# EAGLE design TSOC_USBUART2 (EAGLE 6.6.0)
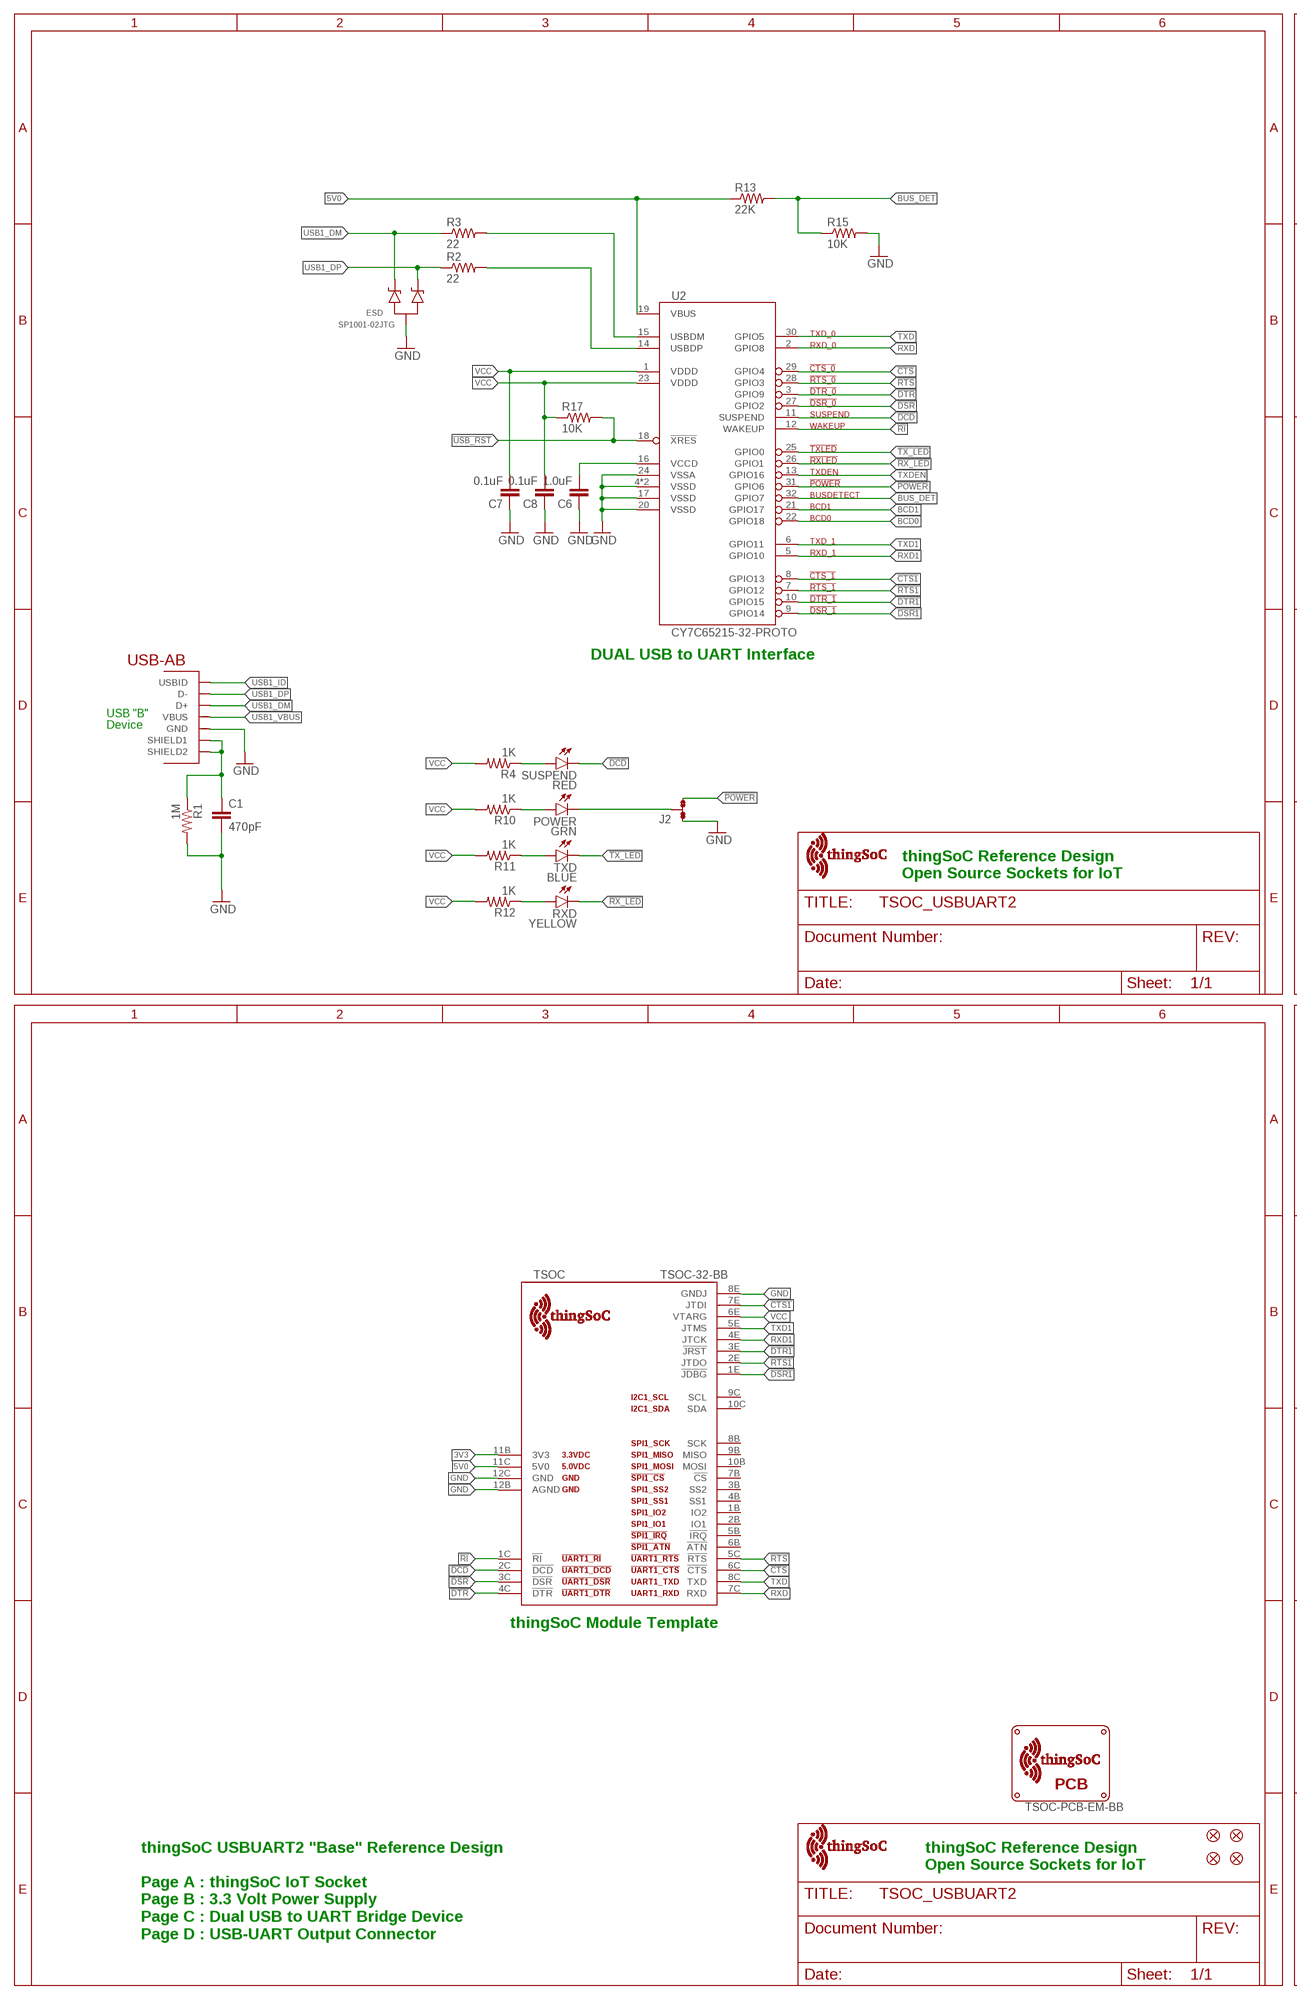
[diagram p0: schematic, sheet 1, part 1 of 2]
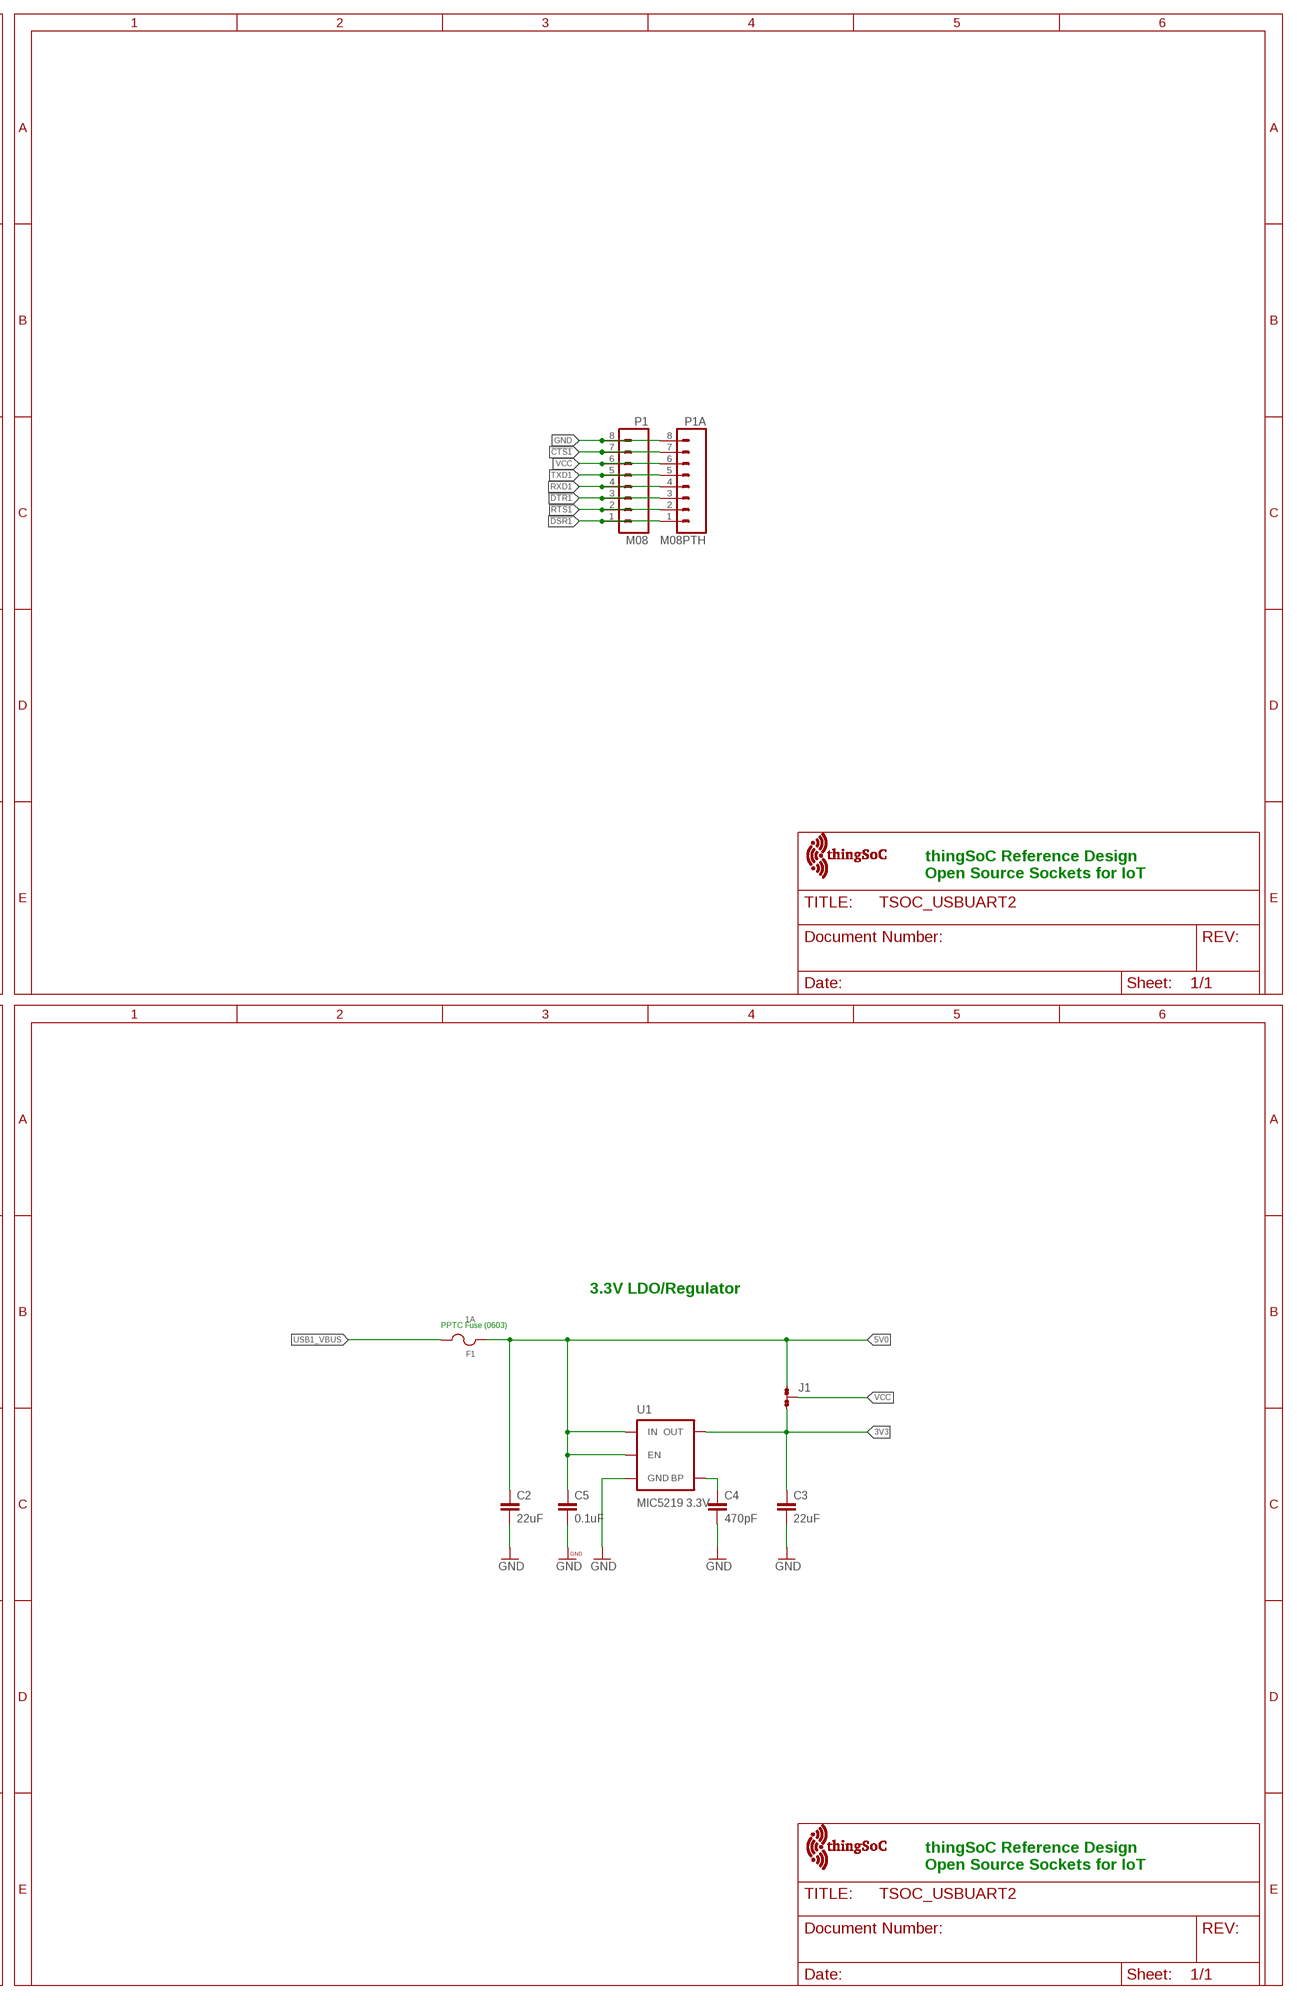
[diagram p1: schematic, sheet 1, part 2 of 2]

## Parts
C1  470pF  CAP-0603  [EIA-0603]
C2  22uF  CAP-1206  [EIA-1206]
C3  22uF  CAP-1206  [EIA-1206]
C4  470pF  CAP-0603  [EIA-0603]
C5  0.1uF  CAP-0603  [EIA-0603]
C6  1.0uF  CAP-0603  [EIA-0603]
C7  0.1uF  CAP-0603  [EIA-0603]
C8  0.1uF  CAP-0603  [EIA-0603]
ESD  SP1001-02JTG  [SC70-3]
F1  1A  FUSE  [EIA-0603]
FID1  FIDUCIALUFIDUCIAL  [MICRO-FIDUCIAL]
FID2  FIDUCIALUFIDUCIAL  [MICRO-FIDUCIAL]
FID3  FIDUCIALUFIDUCIAL  [MICRO-FIDUCIAL]
FID4  FIDUCIALUFIDUCIAL  [MICRO-FIDUCIAL]
J1  JMP-3-1_2  [JMP-3-1_2]
J2  JMP-3-1_2  [JMP-3-1_2]
P1  M08  [1X08-SMD-FEMALE]
P1A  M08PTH  [1X08]
POWER  GRN  LED0603  [LED-0603]
R1  1M  RESISTOR-0603  [EIA-0603]
R2  22  RESISTOR-0603  [EIA-0603]
R3  22  RESISTOR-0603  [EIA-0603]
R4  1K  RESISTOR-0603  [EIA-0603]
R10  1K  RESISTOR-0603  [EIA-0603]
R11  1K  RESISTOR-0603  [EIA-0603]
R12  1K  RESISTOR-0603  [EIA-0603]
R13  22K  RESISTOR-0603  [EIA-0603]
R15  10K  RESISTOR-0603  [EIA-0603]
R17  10K  RESISTOR-0603  [EIA-0603]
RXD  YELLOW  LED0603  [LED-0603]
SUSPEND  RED  LED0603  [LED-0603]
TSOC  TSOC-32-BB  [TSOC-BB-S32]
TXD  BLUE  LED0603  [LED-0603]
U1  MIC5219 3.3V  V_REG_MIC52193.3V  [SOT23-5]
U2  CY7C65215-32-PROTO  [QFN32-PROTO]
U$1  TSOC-PCB-EM-BB  [TSOC-EM-BB]
U$3  TSOC-LOGO-LRG  [TSOC-LOGO-LRG]
U$4  TSOC-LOGO  [TSOC-LOGO-BLANK]
U$5  TSOC-LOGO  [TSOC-LOGO-BLANK]
U$6  TSOC-LOGO  [TSOC-LOGO-BLANK]
USB  USB_AB  [USB-AB-MICRO-SMD]

## Nets
3V3: C3.1 J1.3 TSOC.11B(3V3) U1.5(OUT)
5V0: C2.1 C5.1 F1.1 J1.1 R13.1 TSOC.11C(5V0) U1.1(IN) U1.3(EN) U2.19(VBUS)
!CTS: TSOC.6C(!CTS) U2.29(GPIO4)
!CTS1: P1.7 P1A.7 TSOC.7E(JTDI) U2.8(GPIO13)
!DCD: SUSPEND.C TSOC.2C(!DCD) U2.11(SUSPEND)
!DSR: TSOC.3C(!DSR) U2.27(GPIO2)
!DSR1: P1.1 P1A.1 TSOC.1E(!JDBG) U2.9(GPIO14)
!DTR: TSOC.4C(!DTR) U2.3(GPIO9)
!DTR1: P1.3 P1A.3 TSOC.3E(!JRST) U2.10(GPIO15)
!POWER: J2.3 U2.31(GPIO6)
!RI: TSOC.1C(!RI) U2.12(WAKEUP)
!RTS: TSOC.5C(!RTS) U2.28(GPIO3)
!RTS1: P1.2 P1A.2 TSOC.2E(JTDO) U2.7(GPIO12)
!RX_LED: RXD.C U2.26(GPIO1)
!TX_LED: TXD.C U2.25(GPIO0)
!USB_RST: R17.2 U2.18(!XRES)
BCD0: U2.22(GPIO18)
BCD1: U2.21(GPIO17)
BLU: R11.1 TXD.A
BUS_DET: R13.2 R15.1 U2.32(GPIO7)
BYPASS1: C4.1 U1.4(BP)
GND [vcc]: C1.2 C2.2 C3.2 C4.2 C5.2 C6.1 C7.1 C8.1 ESD.3(A) J2.1 P1.8 P1A.8 R1.2 R15.2 TSOC.8E(GNDJ) TSOC.12B(AGND) TSOC.12C(GND) U1.2(GND) U2.4(VSSD) U2.17(VSSD) U2.20(VSSD) U2.24(VSSA) U2.EXP(VSSD) USB.GND
GRN: POWER.A R10.1
PWR: J2.2 POWER.C
RED: R4.1 SUSPEND.A
RXD: TSOC.7C(RXD) U2.2(GPIO8)
RXD1: P1.4 P1A.4 TSOC.4E(JTCK) U2.5(GPIO10)
TXD: TSOC.8C(TXD) U2.30(GPIO5)
TXD1: P1.5 P1A.5 TSOC.5E(JTMS) U2.6(GPIO11)
TXDEN: U2.13(GPIO16)
USB1_DM: ESD.2(C2) R3.1 USB.D+
USB1_DP: ESD.1(C1) R2.1 USB.D-
USB1_ID: USB.ID(USBID)
USB1_M: R3.2 U2.15(USBDM)
USB1_P: R2.2 U2.14(USBDP)
USB1_SHIELD: C1.1 R1.1 USB.SHIELD1 USB.SHIELD2
USB1_VBUS: F1.2 USB.VBUS
VCC: C7.2 C8.2 J1.2 P1.6 P1A.6 R4.2 R10.2 R11.2 R12.2 R17.1 TSOC.6E(VTARG) U2.1(VDDD) U2.23(VDDD)
VCCD1: C6.2 U2.16(VCCD)
YEL: R12.1 RXD.A
Unconnected: TSOC.1B(IO2) TSOC.2B(IO1) TSOC.3B(SS2) TSOC.4B(SS1) TSOC.5B(!IRQ) TSOC.6B(!ATN) TSOC.7B(!CS) TSOC.8B(SCK) TSOC.9B(MISO) TSOC.9C(SCL) TSOC.10B(MOSI) TSOC.10C(SDA)

## Notes on the sheet
- DUAL USB to UART Interface
- USB "B"
- Device
- thingSoC Reference Design
  Open Source Sockets for IoT
- thingSoC Reference Design
  Open Source Sockets for IoT
- 3.3V LDO/Regulator
- PPTC Fuse (0603)
- thingSoC Module Template
- thingSoC Reference Design
  Open Source Sockets for IoT
- thingSoC Reference Design
  Open Source Sockets for IoT
- thingSoC USBUART2 "Base" Reference Design
  
  Page A : thingSoC IoT Socket
  Page B : 3.3 Volt Power Supply
  Page C : Dual USB to UART Bridge Device
  Page D : USB-UART Output Connector

## Library data of the parts
C1-C8 = TSOC_USBUART2:CAP: Ceramic Capacitor SMD
ESD = TSOC-ESP8266-BASE:SP1001-02JTG: Littelfuse SP1001-02JTG TVS Diode Array 8pf 15kV Source: http://www.littelfuse.com/data/en/Product_Catalogs/Littelfuse_TVS_Diode_Array_SPA_Catalog.pdf patternshed.com: created 3/25/2012
F1 = TSOC_USBUART2:FUSE: Resettable PPTC Fuse - 0603 Footptint
FID1-FID4 = TSOC-ESP8266-BASE:FIDUCIAL: Fiducial Alignment Points Various fiducial points for machine vision alignment.
J1 J2 = PatternAgents-ProtoPads:JMP-3-1_2: Three Terminal Jumper - 1 & 2 Connected Positions 1and 2 are normally connected. PatternAgents ProtoPads Library Schematic and PCB layout libraries for design patterns by PatternAgents. For the CADSoft Eagle CAD program : http://www.cadsoftusa.com/download-eagle/ Source LBR : http://www.patternagents.com Github : https://github.com/PatternAgents License : http://creativecommons.org/licenses/by-sa/4.0/ (Creative Commons 4.0) THIS SOFTWARE IS PROVIDED BY THE CONTRIBUTORS "AS IS" AND WITHOUT ANY EXPRESS OR IMPLIED WARRANTIES, INCLUDING, BUT NOT LIMITED TO, THE IMPLIED WARRANTIES OF MERCHANTABILITY AND FITNESS FOR A PARTICULAR PURPOSE ARE DISCLAIMED. IN NO EVENT SHALL THE COPYRIGHT OWNER OR CONTRIBUTORS BE LIABLE FOR ANY DIRECT, INDIRECT, INCIDENTAL, SPECIAL, EXEMPLARY, OR CONSEQUENTIAL DAMAGES (INCLUDING, BUT NOT LIMITED TO, PROCUREMENT OF SUBSTITUTE GOODS OR SERVICES; LOSS OF USE, DATA, OR PROFITS; OR BUSINESS INTERRUPTION) HOWEVER CAUSED AND ON ANY THEORY OF LIABILITY, WHETHER IN CONTRACT, STRICT LIABILITY, OR TORT (INCLUDING NEGLIGENCE OR OTHERWISE) ARISING IN ANY WAY OUT OF THE USE OF THIS SOFTWARE, EVEN IF ADVISED OF THE POSSIBILITY OF SUCH DAMAGE.; BOM: EXCLUDE
P1 P1A = TSOC_USBUART2:M08
POWER RXD SUSPEND TXD = TSOC-ESP8266-BASE:LED: LEDs Standard schematic elements and footprints for 5mm, 3mm, 1206, and 0603 sized LEDs. 5mm - Spark Fun Electronics SKU : COM-00529 (and others)
R1-R4 R10-R13 R15 R17 = TSOC_USBUART2:RESISTOR
TSOC = thingSoC:TSOC-32: thingSoC Thirty-Two (32) Pin Socket Source LBR : http://www.thingsoc.com Github : https://github.com/thingsoc License : http://creativecommons.org/licenses/by-sa/4.0/ (Creative Commons 4.0) THIS SOFTWARE IS PROVIDED BY THE CONTRIBUTORS "AS IS" AND WITHOUT ANY EXPRESS OR IMPLIED WARRANTIES, INCLUDING, BUT NOT LIMITED TO, THE IMPLIED WARRANTIES OF MERCHANTABILITY AND FITNESS FOR A PARTICULAR PURPOSE ARE DISCLAIMED. IN NO EVENT SHALL THE COPYRIGHT OWNER OR CONTRIBUTORS BE LIABLE FOR ANY DIRECT, INDIRECT, INCIDENTAL, SPECIAL, EXEMPLARY, OR CONSEQUENTIAL DAMAGES (INCLUDING, BUT NOT LIMITED TO, PROCUREMENT OF SUBSTITUTE GOODS OR SERVICES; LOSS OF USE, DATA, OR PROFITS; OR BUSINESS INTERRUPTION) HOWEVER CAUSED AND ON ANY THEORY OF LIABILITY, WHETHER IN CONTRACT, STRICT LIABILITY, OR TORT (INCLUDING NEGLIGENCE OR OTHERWISE) ARISING IN ANY WAY OUT OF THE USE OF THIS SOFTWARE, EVEN IF ADVISED OF THE POSSIBILITY OF SUCH DAMAGE.
U1 = TSOC-ESP8266-BASE:V_REG_MIC5219: V_REG MIC5219 Standard 3.3V and 5V 500mA LDO voltage regulator in SOT-23 layout. Micrel part MIC5219. BP (by-pass) pin is used to lower output noise with 470pF cap, may be left open.; PROD_ID: VREG-09872
U2 = PatternAgents-Cypress:CY7C65215-32: Cypress EZ-USB ® CY7C65215-32QFN DUAL CHANNEL USB TO UART/SPI/IC Bridge Full-Speed USB Peripheral Controller Source Data: http://www.cypress.com/?mpn=CY7C65211-24QFN LBR Source: http://www.patternagents.com THIS SOFTWARE IS PROVIDED BY THE CONTRIBUTORS "AS IS" AND WITHOUT ANY EXPRESS OR IMPLIED WARRANTIES, INCLUDING, BUT NOT LIMITED TO, THE IMPLIED WARRANTIES OF MERCHANTABILITY AND FITNESS FOR A PARTICULAR PURPOSE ARE DISCLAIMED. IN NO EVENT SHALL THE COPYRIGHT OWNER OR CONTRIBUTORS BE LIABLE FOR ANY DIRECT, INDIRECT, INCIDENTAL, SPECIAL, EXEMPLARY, OR CONSEQUENTIAL DAMAGES (INCLUDING, BUT NOT LIMITED TO, PROCUREMENT OF SUBSTITUTE GOODS OR SERVICES; LOSS OF USE, DATA, OR PROFITS; OR BUSINESS INTERRUPTION) HOWEVER CAUSED AND ON ANY THEORY OF LIABILITY, WHETHER IN CONTRACT, STRICT LIABILITY, OR TORT (INCLUDING NEGLIGENCE OR OTHERWISE) ARISING IN ANY WAY OUT OF THE USE OF THIS SOFTWARE, EVEN IF ADVISED OF THE POSSIBILITY OF SUCH DAMAGE.
U$1 = TSOC_USBUART2:TSOC-PCB: thingSoC PCB Outlines Boards Outlines for Standard Sizes (in the DImension Layer) (Registration marks in the tDocu layer - make sure to turn on tDocu/bDocu) Source LBR : http://www.thingsoc.com Github : https://github.com/thingsoc License : http://creativecommons.org/licenses/by-sa/4.0/ (Creative Commons 4.0) THIS SOFTWARE IS PROVIDED BY THE CONTRIBUTORS "AS IS" AND WITHOUT ANY EXPRESS OR IMPLIED WARRANTIES, INCLUDING, BUT NOT LIMITED TO, THE IMPLIED WARRANTIES OF MERCHANTABILITY AND FITNESS FOR A PARTICULAR PURPOSE ARE DISCLAIMED. IN NO EVENT SHALL THE COPYRIGHT OWNER OR CONTRIBUTORS BE LIABLE FOR ANY DIRECT, INDIRECT, INCIDENTAL, SPECIAL, EXEMPLARY, OR CONSEQUENTIAL DAMAGES (INCLUDING, BUT NOT LIMITED TO, PROCUREMENT OF SUBSTITUTE GOODS OR SERVICES; LOSS OF USE, DATA, OR PROFITS; OR BUSINESS INTERRUPTION) HOWEVER CAUSED AND ON ANY THEORY OF LIABILITY, WHETHER IN CONTRACT, STRICT LIABILITY, OR TORT (INCLUDING NEGLIGENCE OR OTHERWISE) ARISING IN ANY WAY OUT OF THE USE OF THIS SOFTWARE, EVEN IF ADVISED OF THE POSSIBILITY OF SUCH DAMAGE.
U$3-U$6 = thingSoC:TSOC-LOGO: thingSoC Logo Source LBR : http://www.thingsoc.com Github : https://github.com/thingsoc License : http://creativecommons.org/licenses/by-sa/4.0/ (Creative Commons 4.0) THIS SOFTWARE IS PROVIDED BY THE CONTRIBUTORS "AS IS" AND WITHOUT ANY EXPRESS OR IMPLIED WARRANTIES, INCLUDING, BUT NOT LIMITED TO, THE IMPLIED WARRANTIES OF MERCHANTABILITY AND FITNESS FOR A PARTICULAR PURPOSE ARE DISCLAIMED. IN NO EVENT SHALL THE COPYRIGHT OWNER OR CONTRIBUTORS BE LIABLE FOR ANY DIRECT, INDIRECT, INCIDENTAL, SPECIAL, EXEMPLARY, OR CONSEQUENTIAL DAMAGES (INCLUDING, BUT NOT LIMITED TO, PROCUREMENT OF SUBSTITUTE GOODS OR SERVICES; LOSS OF USE, DATA, OR PROFITS; OR BUSINESS INTERRUPTION) HOWEVER CAUSED AND ON ANY THEORY OF LIABILITY, WHETHER IN CONTRACT, STRICT LIABILITY, OR TORT (INCLUDING NEGLIGENCE OR OTHERWISE) ARISING IN ANY WAY OUT OF THE USE OF THIS SOFTWARE, EVEN IF ADVISED OF THE POSSIBILITY OF SUCH DAMAGE.
USB = BeeSafe:USB_AB: This is a USB AB connector that is compatible with USB OTG. i.e. this connector can serve as a host or device

## Net classes
1 vcc: width 0.254 mm

## Board
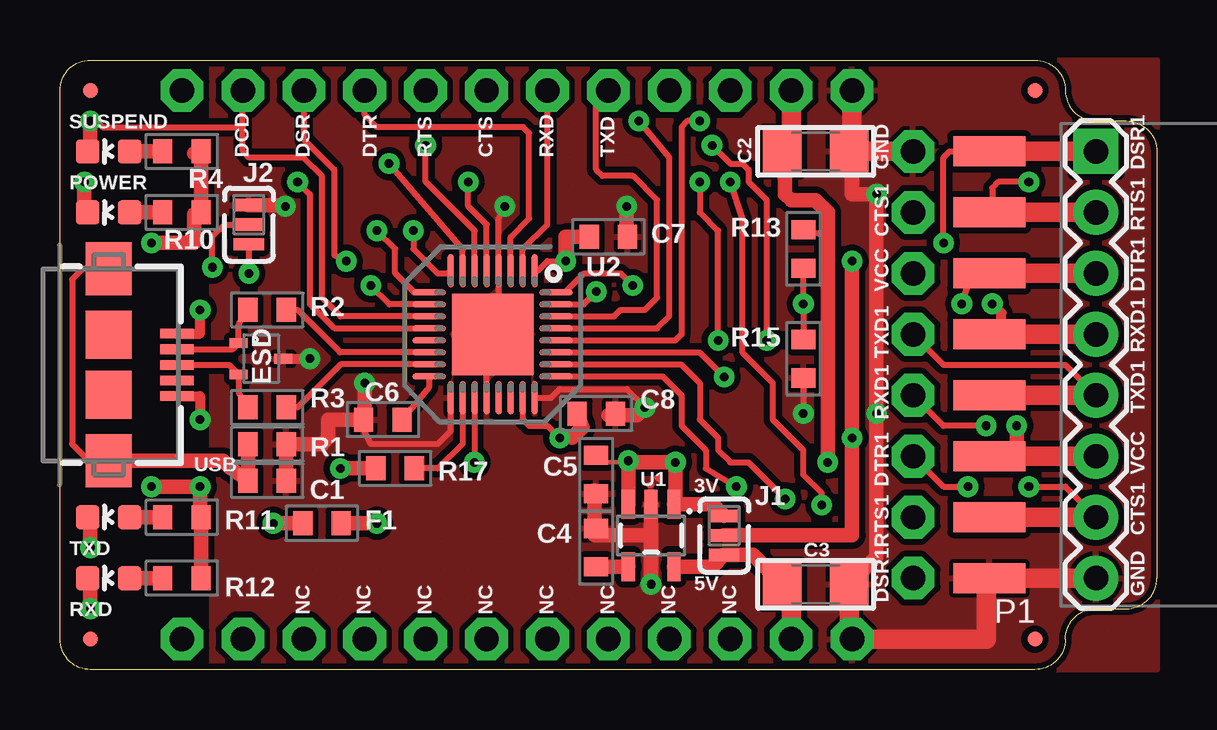
[diagram p2: board, top side]
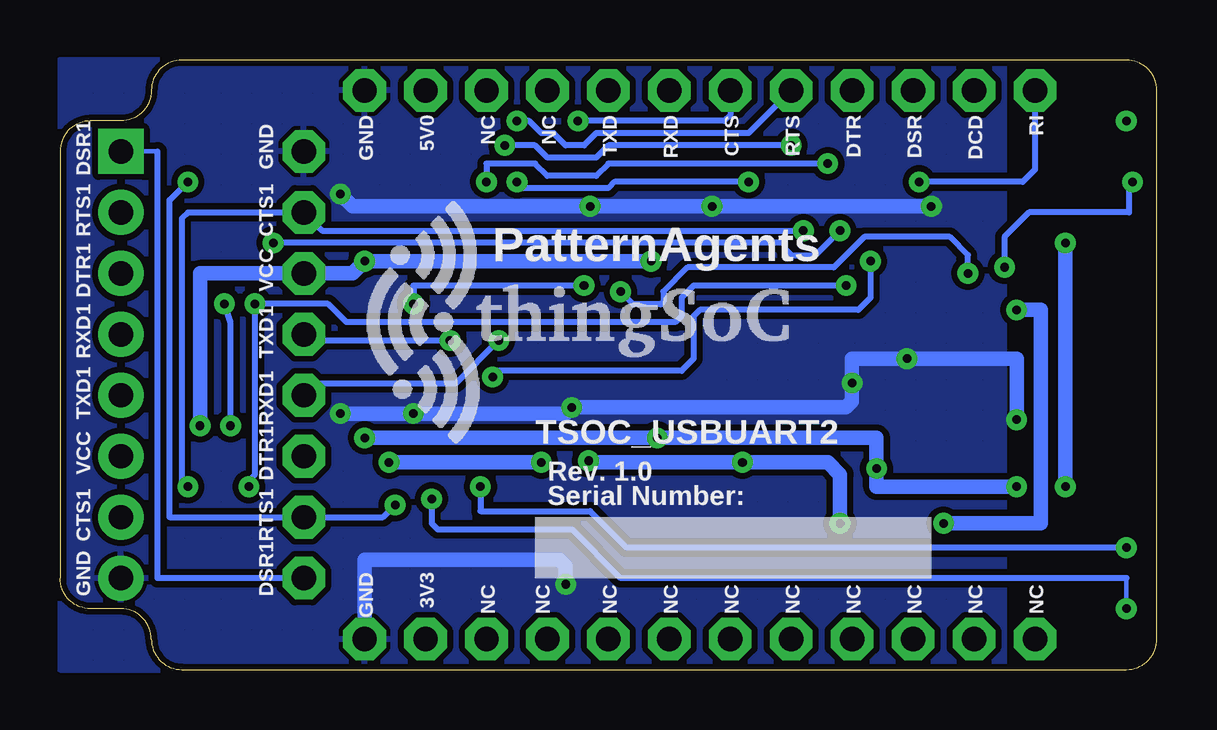
[diagram p3: board, bottom side, seen from below]

Size 45.72 x 25.4 mm. Coordinates in mm from the lower left corner, seen from the top.
Copper layers (1*16): Top 0.035mm / dielectric 1.5mm / Bottom 0.035mm
Design rules "PatternAgents_7mil": minimum track width 7mil, minimum drill 14mil, track to track 7mil, track to pad 7mil, pad to pad 7mil, via to via 7mil, smd to smd 7mil, copper to edge 7mil, drill to drill 7mil, minimum pad ring 12mil, minimum via ring 10mil, stop-mask expansion 4mil, vias tented up to drill 25mil, thermal gap 7mil

### Footprints (pad centres in the part's own frame; a part is rotated, then mirrored left to right if it is on the bottom)
EIA-0603 = smd 0.8 x 1: 1 -0.8,0; 2 0.8,0
EIA-1206 = smd 1.6 x 1.8: 1 -1.4,0; 2 1.4,0
SC70-3 = smd 0.4 x 0.75: 1 -0.65,-0.925; 2 0.65,-0.925; 3 0,0.925
MICRO-FIDUCIAL = smd 0.635 x 0.635: 1 0,0
JMP-3-1_2 = smd 0.508 x 1.27: 1 -0.813,0; 2 0,0; 3 0.813,0
1X08-SMD-FEMALE = smd 1.25 x 3: 1 8.89,3.425; 2 6.35,3.425; 3 3.81,3.425; 4 1.27,3.425; 5 -1.27,3.425; 6 -3.81,3.425; 7 -6.35,3.425; 8 -8.89,3.425
1X08 = drill 1.016 pad 1.88 square: 1 0,0 | drill 1.016 pad 1.88: 2 2.54,0; 3 5.08,0; 4 7.62,0; 5 10.16,0; 6 12.7,0; 7 15.24,0; 8 17.78,0
LED-0603 = smd 1 x 1: A 0,-0.877; C 0,0.877
TSOC-BB-S32 = drill 1.016 pad 1.778 octagon: 1B -11.43,-11.43; 1C -11.43,11.43; 1E 19.05,-8.89; 2B -8.89,-11.43; 2C -8.89,11.43; 2E 19.05,-6.35; 3B -6.35,-11.43; 3C -6.35,11.43; 3E 19.05,-3.81; 4B -3.81,-11.43; 4C -3.81,11.43; 4E 19.05,-1.27; 5B -1.27,-11.43; 5C -1.27,11.43; 5E 19.05,1.27; 6B 1.27,-11.43; 6C 1.27,11.43; 6E 19.05,3.81; 7B 3.81,-11.43; 7C 3.81,11.43; 7E 19.05,6.35; 8B 6.35,-11.43; 8C 6.35,11.43; 8E 19.05,8.89; 9B 8.89,-11.43; 9C 8.89,11.43; 10B 11.43,-11.43; 10C 11.43,11.43; 11B 13.97,-11.43; 11C 13.97,11.43; 12B 16.51,-11.43; 12C 16.51,11.43
SOT23-5 = smd 0.55 x 1.2: 1 -0.95,-1.3; 2 0,-1.3; 3 0.95,-1.3; 4 0.95,1.3; 5 -0.95,1.3
QFN32-PROTO = smd 1.4 x 0.254: 1 -2.65,1.75; 2 -2.65,1.25; 3 -2.65,0.75; 4 -2.65,0.25; 5 -2.65,-0.25; 6 -2.65,-0.75; 7 -2.65,-1.25; 8 -2.65,-1.75; 17 2.65,-1.75; 18 2.65,-1.25; 19 2.65,-0.75; 20 2.65,-0.25; 21 2.65,0.25; 22 2.65,0.75; 23 2.65,1.25; 24 2.65,1.75 | smd 0.254 x 1.4: 9 -1.75,-2.65; 10 -1.25,-2.65; 11 -0.75,-2.65; 12 -0.25,-2.65; 13 0.25,-2.65; 14 0.75,-2.65; 15 1.25,-2.65; 16 1.75,-2.65; 25 1.75,2.65; 26 1.25,2.65; 27 0.75,2.65; 28 0.25,2.65; 29 -0.25,2.65; 30 -0.75,2.65; 31 -1.25,2.65; 32 -1.75,2.65 | smd 3.4 x 3.4: EXP 0,0
USB-AB-MICRO-SMD = smd 1.4 x 0.4: D+ 2.85,0; D- 2.85,0.65; GND 2.85,-1.3; ID 2.85,-0.65; VBUS 2.85,1.3 | smd 1.9 x 2: P$6 0,1.25; P$7 0,-1.25 | smd 1.9 x 2.2: SHIELD1 0,4; SHIELD2 0,-4

### Placement (x,y rotation side)
C1  8.64,7.87 0 top
C2  31.5,21.59 0 top
C3  31.5,3.56 0 top
C4  22.35,5.08 90 top
C5  22.35,8.13 270 top
C6  13.46,10.41 0 top
C7  22.86,18.03 180 top
C8  22.35,10.67 180 top
ESD  8.38,12.95 270 top
F1  10.92,6.1 180 top
FID1  1.27,24.13 0 top
FID2  1.27,1.27 0 top
FID3  40.64,1.27 0 top
FID4  40.64,24.13 0 top
J1  27.69,5.59 270 top
J2  7.87,18.54 270 top
P1  42.16,12.7 90 top
P1A  43.18,21.59 270 top
POWER  2.03,19.05 90 top
R1  8.64,9.4 0 top
R2  8.64,14.99 0 top
R3  8.64,10.92 0 top
R4  5.08,21.59 0 top
R10  5.08,19.05 0 top
R11  5.08,6.35 0 top
R12  5.08,3.81 0 top
R13  30.99,17.53 270 top
R15  30.99,12.95 270 top
R17  13.97,8.38 0 top
RXD  2.03,3.81 90 top
SUSPEND  2.03,21.59 90 top
TSOC  16.51,12.7 0 top
TXD  2.03,6.35 90 top
U1  24.64,5.59 180 top
U2  18.03,13.97 270 top
U$1  19.05,12.7 0 top
U$3  29.72,14.48 0 bottom
U$4  1.27,1.27 0 top
U$5  1.27,1.27 0 top
U$6  1.27,1.27 0 top
USB  2.03,12.7 0 top

### Tracks (layer width: path | path; a pad name or v marks a point on that pad's centre or on a via)
3V3
  Top 0.61: U1.5 27.2,4.29 J1.3 28.88,4.78 C3.1
  Top 0.813: TSOC.11B 30.48,3.17 C3.1
5V0  (via drill 0.36)
  Top 0.178: C5.1 22.35,8.64 23.37,8.64 v23.69,8.7
  Top 0.254: R13.1 31.93,18.11 32,18.03 | U2.19 17.28,9.92 v17.27,8.64
  Top 0.61: J1.1 27.2,6.89 U1.1 25.65,6.95 v25.65,8.64 23.62,8.64 v23.69,8.7 | v23.69,8.7 U1.3 | v32,8.64 32,18.03 32,19.05 31.5,19.56 30.48,19.56 30.23,19.81 30.23,21.46 C2.1 30.2,21.7 30.48,21.7 | v23.68,8.71 v23.69,8.7 | F1.1 v13.21,6.1
  Top 0.813: 30.48,21.7 TSOC.11C
  Bottom 0.61: v25.65,8.64 v32,8.64 | v23.69,8.7 23.62,8.64 v17.27,8.64 13.72,8.64 13.21,8.13 v13.21,6.1
!CTS  (via drill 0.36)
  Top 0.254: U2.29 24.89,14.22 25.4,14.73 25.4,21.34 v24.13,22.86
  Bottom 0.254: TSOC.6C 17.78,23.11 18.03,22.86 v24.13,22.86
!CTS1  (via drill 0.36)
  Top 0.254: v40.39,7.62 41.91,7.62 P1A.7 | v14.73,18.29 14.73,17.53 15.75,16.51 16.17,16.51 U2.8
  Top 0.813: P1.7 P1A.7
  Bottom 0.254: v40.39,7.62 40.64,7.87 40.64,18.8 40.39,19.05 TSOC.7E 34.8,18.29 v14.73,18.29
!DCD  (via drill 0.36)
  Top 0.254: v1.27,22.86 1.52,22.86 1.78,22.61 7.62,22.61 | 7.62,22.61 TSOC.2C | U2.11 11.7,14.72 10.92,15.49 10.92,20.57 10.16,21.34 7.87,21.34 7.62,21.59 7.62,22.61
  Top 0.61: SUSPEND.C 1.27,21.59 v1.27,22.86
!DSR  (via drill 0.36)
  Top 0.254: TSOC.3C 10.16,22.1 11.43,20.83 11.43,17.27 v11.94,17.02 | v27.69,12.19 26.66,13.22 U2.27
  Bottom 0.254: v11.94,17.02 11.94,15.49 12.45,14.99 19.05,14.99 19.3,14.73 19.3,12.95 19.81,12.45 27.43,12.45 v27.69,12.19
!DSR1  (via drill 0.36)
  Top 0.254: v36.83,17.78 36.83,21.34 37.08,21.59 P1.1 | U2.9 14.76,15.72 13.97,16.51 13.97,17.53 v13.21,18.29
  Top 0.813: P1.1 P1A.1
  Bottom 0.178: P1A.1 41.66,21.59
  Bottom 0.254: TSOC.1E 41.66,3.81 41.66,21.59 | v36.83,17.78 15.49,17.78 15.49,17.53 15.24,17.27 14.22,17.27 v13.21,18.29
!DTR
  Top 0.254: TSOC.4C 12.7,23.11 13.21,22.61 19.3,22.61 19.56,22.35 19.56,18.8 18.78,18.02 U2.3
!DTR1  (via drill 0.36)
  Top 0.254: TSOC.3E 36.83,7.62 v37.85,7.62 | v37.59,15.24 37.85,16 38.1,16.51 P1.3 | U2.10 13.74,15.22 v12.95,16
  Top 0.813: P1.3 P1A.3
  Bottom 0.254: v37.85,7.62 37.85,7.87 37.59,8.13 v37.59,15.24 34.54,15.24 33.78,14.48 20.07,14.48 19.81,14.73 19.81,15.49 19.3,16 v12.95,16
!POWER  (via drill 0.36)
  Top 0.254: J2.3 v7.87,16.51 | U2.31 21.82,15.22 v22.35,15.75
  Bottom 0.254: v7.87,16.51 7.87,17.27 8.64,18.03 12.19,18.03 13.46,16.76 19.56,16.76 20.57,15.75 20.57,15.33 U2.31 21.82,15.22 v22.35,15.75
!RI  (via drill 0.36)
  Top 0.254: U2.12 11.43,14.22 10.41,15.24 10.41,19.81 v9.91,20.32
  Bottom 0.254: TSOC.1C 5.08,20.83 5.59,20.32 v9.91,20.32
!RTS  (via drill 0.36)
  Top 0.254: U2.28 25.65,13.72 25.91,13.97 25.91,22.61 26.16,22.86 v26.67,22.86
  Bottom 0.254: TSOC.5C 17.02,22.35 23.37,22.35 23.88,21.84 24.64,21.84 25.15,22.35 25.65,22.35 26.16,22.86 v26.67,22.86
!RTS1  (via drill 0.36)
  Top 0.254: v40.39,20.32 39.12,20.32 38.86,20.07 38.86,19.17 P1.2 | U2.7 16.78,17.51 v13.72,21.08 | v31.75,6.86 31.75,7.37 30.99,8.13 30.99,9.14 29.72,10.41 29.72,11.94 28.45,13.21 28.45,18.8 v27.94,20.32
  Top 0.813: P1.2 P1A.2
  Bottom 0.254: v40.39,20.32 41.15,19.56 41.15,6.35 TSOC.2E 32.26,6.35 v31.75,6.86 | v13.72,21.08 22.86,21.08 23.37,20.57 25.4,20.57 25.91,21.08 27.94,21.08 v27.94,20.32
!RX_LED  (via drill 0.36)
  Top 0.254: U2.26 25.89,12.72 26.67,11.94 26.67,10.41 27.43,9.65 27.43,9.14 27.94,8.64 28.7,8.64 v30.23,7.11
  Top 0.61: RXD.C 1.27,3.81 v1.27,2.54
  Bottom 0.178: v1.27,2.54 1.27,3.81
  Bottom 0.254: 1.27,3.81 22.35,3.81 24.38,5.84 29.97,5.84 30.23,6.1 v30.23,7.11
!TX_LED  (via drill 0.36)
  Top 0.254: U2.25 25.12,12.22 25.91,11.43 25.91,10.16 26.92,9.14 26.92,8.38 v28.19,7.62
  Top 0.61: TXD.C 1.27,6.35 v1.27,5.08
  Bottom 0.254: v1.27,5.08 22.1,5.08 23.62,6.6 28.19,6.6 v28.19,7.62
!USB_RST
  Top 0.254: U2.18 16.78,9.42 15.75,8.38 R17.2
BLU
  Top 0.61: R11.1 TXD.A
BUS_DET  (via drill 0.36)
  Top 0.254: R13.2 v30.99,15.24 R15.1 | U2.32 21.05,15.72 21.84,16.51 23.37,16.51 v23.88,16
  Bottom 0.254: v23.88,16 30.99,16 v30.99,15.24
BYPASS1
  Top 0.61: U1.4 22.56,4.29 C4.1
GND  (via drill 0.36)
  Top 0.254: v18.54,19.3 18.28,18.8 U2.4 18.28,14.22 U2.EXP 17.78,13.72 U2.20 | 22.86,10.74 C8.1 | U2.24 20.46,11.32 20.83,11.68 23.62,11.68 v24.38,10.92 | R15.2 v30.99,10.67 | 12.7,10.49 C6.1 12.7,10.63 12.7,9.91 12.95,9.4 15.75,9.4 16.28,9.93 U2.17 | U1.2 24.56,6.99 24.74,6.99 U1.2 | 24.56,7.7 24.65,7.7 | U1.2 24.56,6.81 U1.2 | U1.2 24.54,6.93 24.65,6.93 24.71,6.93 U1.2 | 24.89,8 24.97,7.95
  Top 0.406: USB.GND 5.84,11.4 v5.84,10.41 | ESD.3 v10.41,12.95
  Top 0.61: C1.2 R1.2 10.92,9.4 11.18,9.65 11.18,10.41 C6.1 12.7,10.71 v12.7,11.94 | C8.1 22.86,10.6 24.06,10.6 v24.38,10.92 | C5.2 22.28,7.48 22.28,5.59 C4.2 22.42,5.59 24.64,5.59 | J2.1 9.35,19.36 v9.4,19.3 | U1.2 24.64,5.59 | 24.64,5.59 v24.64,3.56 | C7.1 23.62,18.03 v23.62,19.3 | C2.2 33.02,21.47 33.02,19.81 v34.04,19.81 v34.04,10.67 34.04,4.7 C3.2
  Top 0.813: P1A.8 P1.8 38.61,3.81 38.61,1.27 TSOC.12B | 33,1.29 TSOC.12B | TSOC.12C 33.02,21.59 TSOC.8E | C3.2 32.9,1.39 TSOC.12B
  Bottom 0.61: v5.84,10.41 5.84,12.95 v10.41,12.95 12.7,12.95 v12.7,11.94 12.7,11.18 12.95,10.92 v24.38,10.92 24.64,10.67 v30.99,10.67 v34.04,10.67 | v34.04,19.81 33.53,19.3 v23.62,19.3 v18.54,19.3 v9.4,19.3 | TSOC.12B 33.02,4.57 24.89,4.57 24.64,4.32 v24.64,3.56
  pour Top (isolate 0.254, hatched): 45.72,25.4 45.72,0 6.35,0 6.35,25.4
  pour Bottom (isolate 0.254, hatched): 45.72,25.4 45.72,0 6.35,0 6.35,25.4
GRN
  Top 0.61: R10.1 POWER.A
PWR  (via drill 0.36)
  Top 0.254: v6.35,16.76 6.35,18.03 6.86,18.54 J2.2
  Top 0.61: v1.02,20.32 1.02,19.19 POWER.C
  Bottom 0.254: v1.02,20.32 1.16,20.18 POWER.C 5.33,19.05 6.35,18.03 v6.35,16.76
RED
  Top 0.61: R4.1 SUSPEND.A
RXD
  Top 0.254: U2.2 19.28,17.51 20.32,18.54 TSOC.7C
RXD1  (via drill 0.36)
  Top 0.178: 39.37,13.97 39.25,14.1
  Top 0.254: v38.61,10.16 36.83,10.16 TSOC.4E | U2.5 17.78,18.54 17.02,19.3 v17.02,20.32 | v27.43,13.72 27.43,18.29 26.67,19.05 v26.67,20.32
  Top 0.406: 39.25,14.1 39.25,14.86 v38.86,15.24
  Top 0.813: P1.4 39.37,13.97 P1A.4
  Bottom 0.254: v38.61,10.16 38.61,14.48 v38.86,15.24 | TSOC.4E 35.05,11.94 29.21,11.94 v27.43,13.72 | v17.02,20.32 22.61,20.32 22.86,20.07 26.67,20.07 v26.67,20.32
TXD
  Top 0.254: U2.30 23.1,14.72 23.37,14.99 24.38,14.99 24.89,15.49 24.89,19.56 23.88,20.57 22.61,20.57 22.35,20.83 22.35,23.62 TSOC.8C
TXD1  (via drill 0.36)
  Top 0.254: TSOC.5E 36.83,12.7 41.91,12.7 P1A.5 | v29.46,13.72 29.46,19.56 28.7,20.32 28.7,20.83 28.45,21.08 27.94,21.08 v27.18,21.84 | U2.6 17.28,18.28 15.24,20.32 v15.24,21.84
  Top 0.813: P1.5 P1A.5
  Bottom 0.254: TSOC.5E 35.31,13.72 v29.46,13.72 | v15.24,21.84 22.86,21.84 23.37,21.34 25.4,21.34 25.91,21.84 v27.18,21.84
USB1_DM
  Top 0.254: USB.D+ 7.06,12.7 ESD.2 7.46,11.52 R3.1
USB1_DP
  Top 0.254: USB.D- 7.2,13.35 ESD.1 7.46,14.39 R2.1
USB1_M
  Top 0.254: U2.15 11.7,12.72 9.91,10.92 R3.2
USB1_P
  Top 0.254: U2.14 11.67,13.22 9.91,14.99 R2.2
USB1_SHIELD
  Top 0.254: USB.SHIELD1 0.95,16.7 0.51,16.26 0.51,9.4 1.02,8.89 1.84,8.89 USB.SHIELD2
  Top 0.61: USB.SHIELD2 6.79,8.7 7.11,8.38 C1.1 R1.1
USB1_VBUS  (via drill 0.36)
  Top 0.406: USB.VBUS 5.84,14 v5.84,14.99
  Top 0.61: v8.89,6.1 F1.2
  Bottom 0.61: v5.84,14.99 4.83,14.99 4.83,6.1 v8.89,6.1
VCC  (via drill 0.36)
  Top 0.178: v20.83,9.65 21.34,9.65
  Top 0.254: U2.1 19.92,16.62 20.32,17.02 v21.08,17.02 | U2.23 19.28,10.43 19.56,10.16 20.32,10.16 v20.83,9.65
  Top 0.61: 5.59,21.52 R4.2 R10.2 5.59,18.98 5.59,17.78 v3.81,17.78 | R12.2 R11.2 5.84,6.39 v5.84,7.62 v3.81,7.62 | v33.02,17.02 v33.02,9.65 33.02,5.59 J1.2 | v39.88,10.16 39.88,8.89 | C8.2 21.77,10.09 21.34,9.65 | C7.2 21.08,18.03 v21.08,17.02 | R17.1 v11.68,8.38
  Top 0.813: P1.6 39.88,8.89 P1A.6
  Bottom 0.61: v39.88,10.16 39.88,16.51 TSOC.6E 33.53,16.51 v33.02,17.02 v21.08,17.02 | v3.81,17.78 v3.81,7.62 | v33.02,9.65 v20.83,9.65 11.68,9.65 v11.68,8.38 11.68,7.62 v5.84,7.62
VCCD1
  Top 0.254: U2.16 15.38,11.76 C6.2
YEL
  Top 0.61: R12.1 RXD.A

### Text on the board
tPlace: DCD | DSR | DTR | RTS | CTS | RXD | TXD | GND | DSR1 | CTS1 | RTS1 | VCC | DTR1 | TXD1 | RXD1 | TXD1 | RXD1 | DTR1 | VCC | 3V | CTS1 | RTS1 | 5V | DSR1 | GND | NC | NC | NC | NC | NC | NC | NC | NC
bPlace: RI | DCD | DSR | DTR | RTS | CTS | RXD | TXD | NC | NC | 5V0 | GND | GND | DSR1 | CTS1 | RTS1 | PatternAgents | VCC | DTR1 | TXD1 | RXD1 | RXD1 | TXD1 | TSOC_USBUART2 | Rev. 1.0 | DTR1 | VCC | Serial Number: | RTS1 | CTS1 | NC | NC | NC | NC | NC | NC | NC | NC | NC | NC | 3V3 | GND | DSR1 | GND